# EAGLE board marbles_v70 (EAGLE 9.6.2)
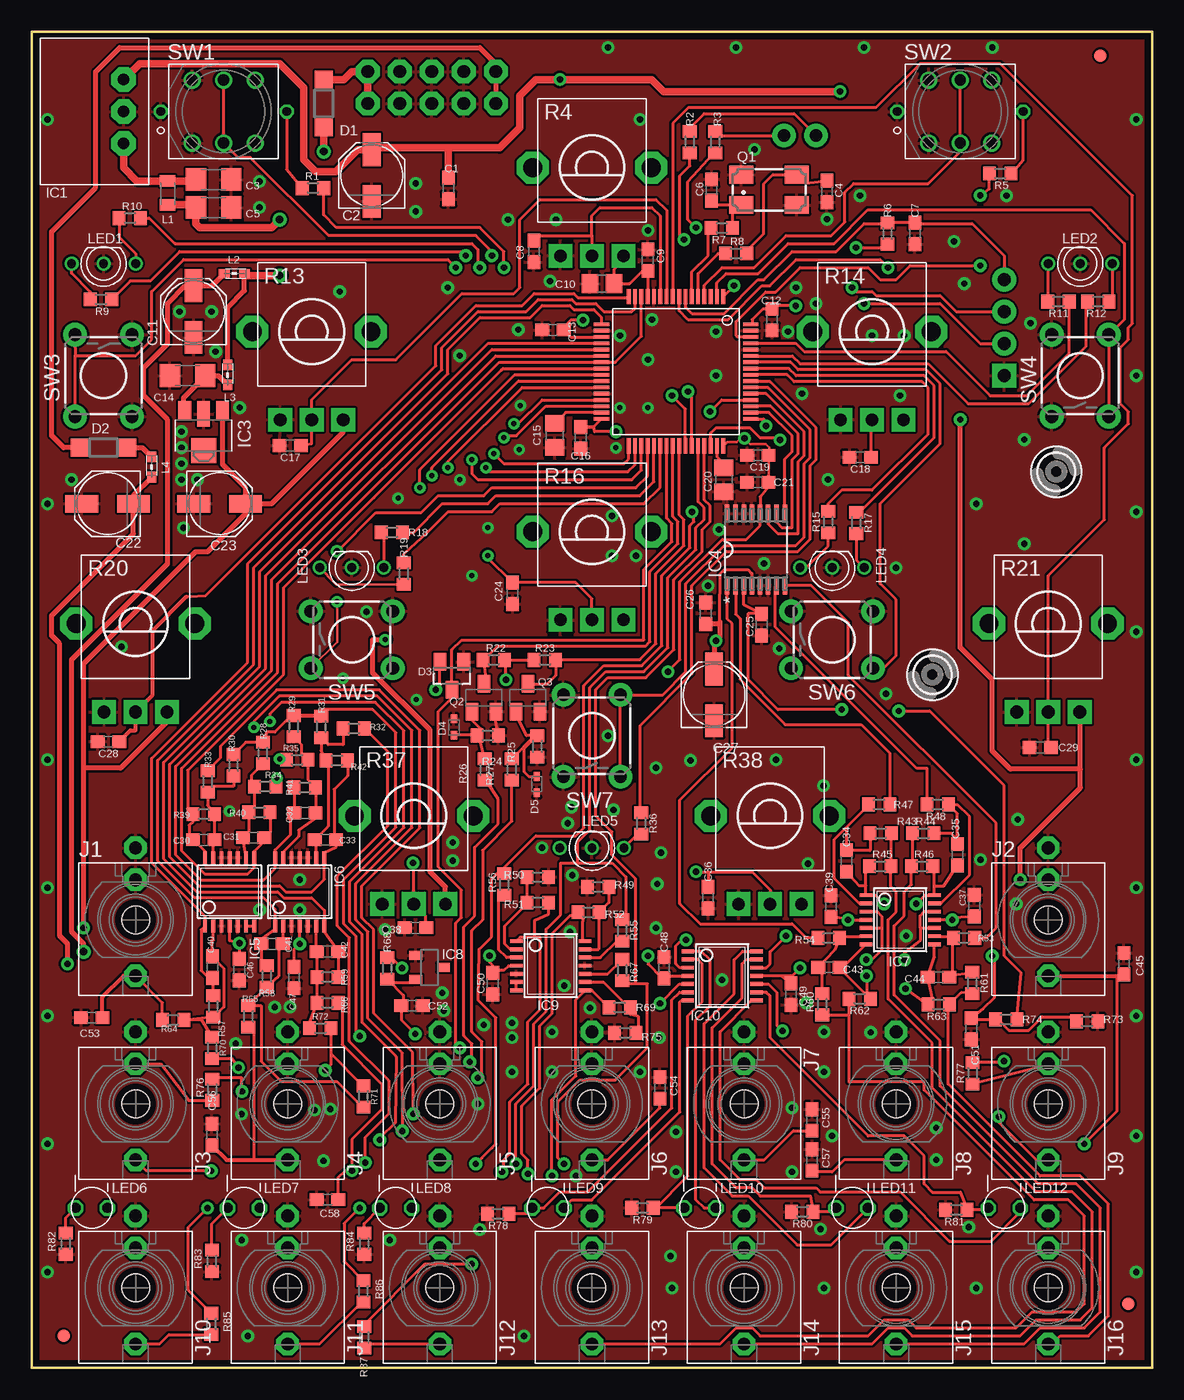
[diagram p5: board, top side]
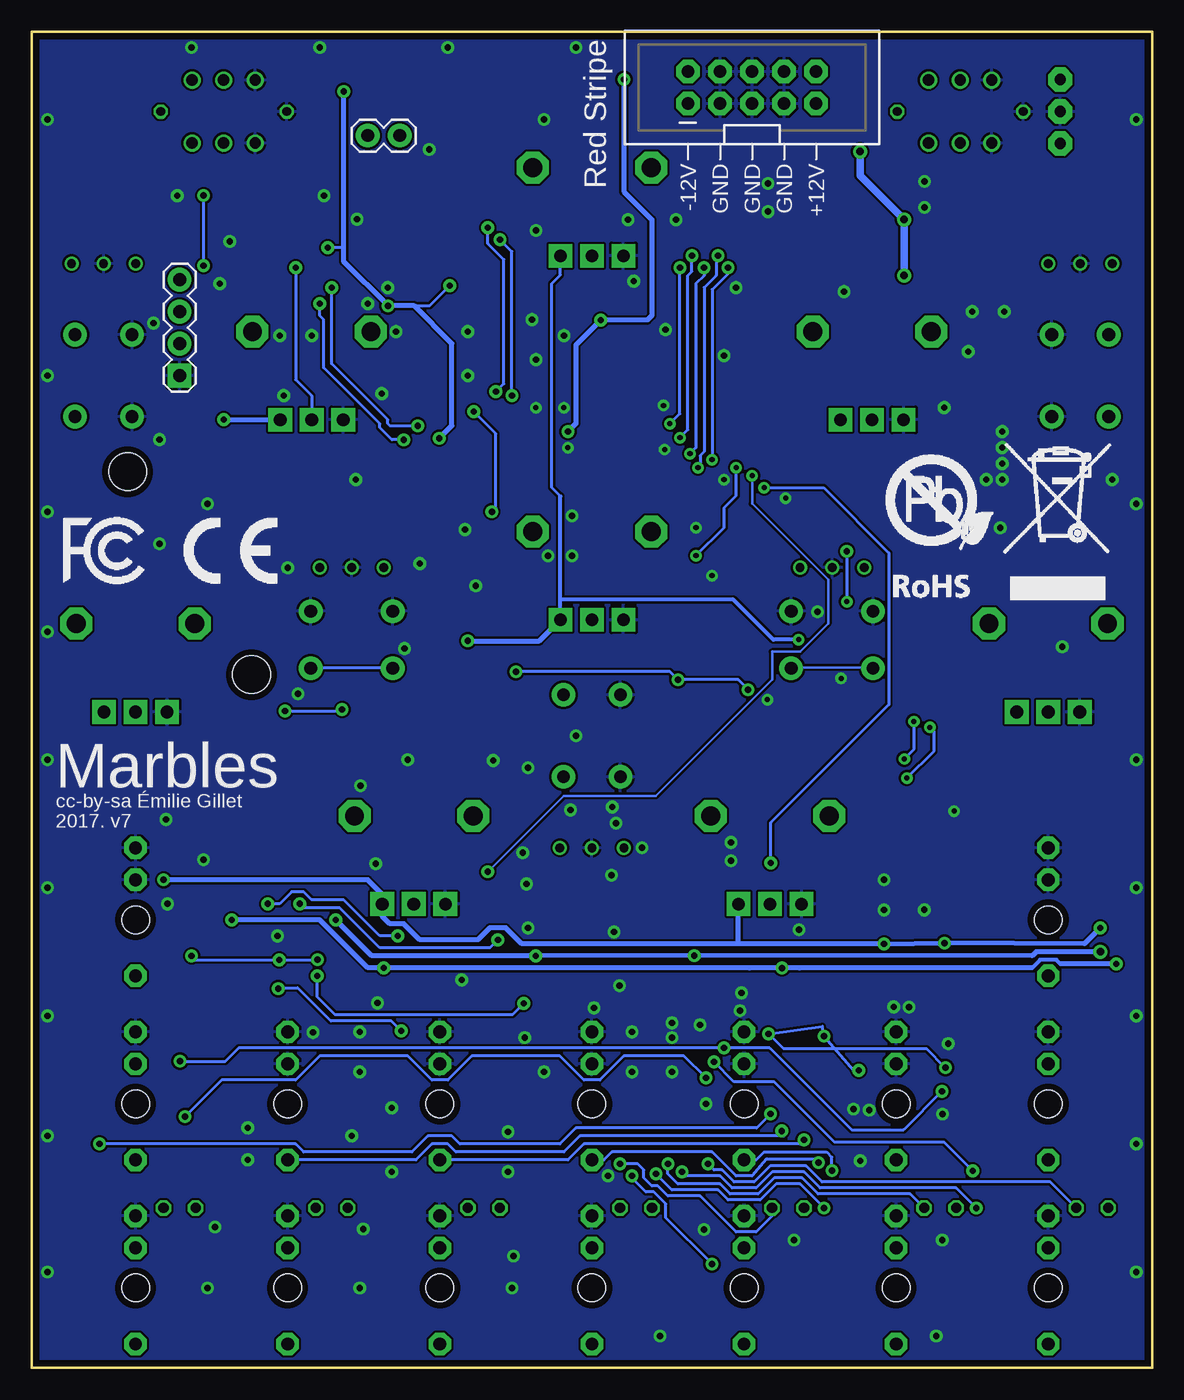
[diagram p6: board, bottom side, seen from below]

Size 88.9 x 106.05 mm. Coordinates in mm from the lower left corner, seen from the top.
Outline: 0,0 88.9,0 88.9,106.05 0,106.05 0,0
Copper layers (1*16): Top 0.035mm / dielectric 1.5mm / Bottom 0.035mm
Design rules "PCBCart-Standard-Fine *": minimum track width 8mil, minimum drill 0.2mm, track to track 7mil, track to pad 7mil, pad to pad 7mil, via to via 7mil, smd to smd 7mil, copper to edge 20mil, drill to drill 8mil, minimum pad ring 8mil, minimum via ring 10mil, stop-mask expansion 3mil, vias tented up to drill 25mil, thermal gap 8mil

## Footprints (pad centres in the part's own frame; a part is rotated, then mirrored left to right if it is on the bottom)
C0603 = smd 1.1 x 1: 1 -0.85,0; 2 0.85,0
PANASONIC_C = smd 2.6 x 1.4: + 2.05,0; - -2.05,0
C1206 = smd 1.6 x 1.8: 1 -1.4,0; 2 1.4,0
C0805 = smd 1.3 x 1.5: 1 -0.95,0; 2 0.95,0
SOD123 = smd 1.4 x 1.4: A 1.9,0; C -1.9,0
SOT23 = smd 1 x 1.4: 1 -0.95,-1.1; 2 0.95,-1.1; 3 0,1.1
SOD523 = smd 0.7 x 0.5: A 0.7,0; C -0.6,0
FIDUCIAL-1X2 = smd 1 x 1: 1 0,0
3,0TINY = hole 3: 0,0
WE78 = drill 0.9 pad 1.93 octagon: 1 -2.54,0; 2 0,0; 3 2.54,0
TQFP-10X10-64 = smd 1.2 x 0.3: 1 -5.936,3.75; 2 -5.936,3.25; 3 -5.936,2.75; 4 -5.936,2.25; 5 -5.936,1.75; 6 -5.936,1.25; 7 -5.936,0.75; 8 -5.936,0.25; 9 -5.936,-0.25; 10 -5.936,-0.75; 11 -5.936,-1.25; 12 -5.936,-1.75; 13 -5.936,-2.25; 14 -5.936,-2.75; 15 -5.936,-3.25; 16 -5.936,-3.75; 33 5.886,-3.75; 34 5.886,-3.25; 35 5.886,-2.75; 36 5.886,-2.25; 37 5.886,-1.75; 38 5.886,-1.25; 39 5.886,-0.75; 40 5.886,-0.25; 41 5.886,0.25; 42 5.886,0.75; 43 5.886,1.25; 44 5.886,1.75; 45 5.886,2.25; 46 5.886,2.75; 47 5.886,3.25; 48 5.886,3.75 | smd 0.3 x 1.2: 17 -3.75,-5.911; 18 -3.25,-5.911; 19 -2.75,-5.911; 20 -2.25,-5.911; 21 -1.75,-5.911; 22 -1.25,-5.911; 23 -0.75,-5.911; 24 -0.25,-5.911; 25 0.25,-5.911; 26 0.75,-5.911; 27 1.25,-5.911; 28 1.75,-5.911; 29 2.25,-5.911; 30 2.75,-5.911; 31 3.25,-5.911; 32 3.75,-5.911; 49 3.75,5.936; 50 3.25,5.936; 51 2.75,5.936; 52 2.25,5.936; 53 1.75,5.936; 54 1.25,5.936; 55 0.75,5.936; 56 0.25,5.936; 57 -0.25,5.936; 58 -0.75,5.936; 59 -1.25,5.936; 60 -1.75,5.936; 61 -2.25,5.936; 62 -2.75,5.936; 63 -3.25,5.936; 64 -3.75,5.936
SOT89 = smd 1 x 1.5: 1 -1.499,-1.981; 3 1.499,-1.981 | smd 1 x 2: 2 0,-1.727 | smd 2 x 2: 2@1 0,1.194
SOP65P640X110-16N = smd 1.422 x 0.356: 1 -2.845,2.286; 2 -2.845,1.626; 3 -2.845,0.965; 4 -2.845,0.33; 5 -2.845,-0.33; 6 -2.845,-0.965; 7 -2.845,-1.626; 8 -2.845,-2.286; 9 2.845,-2.286; 10 2.845,-1.626; 11 2.845,-0.965; 12 2.845,-0.33; 13 2.845,0.33; 14 2.845,0.965; 15 2.845,1.626; 16 2.845,2.286
TSSOP14_065 = smd 0.305 x 0.991: 1 -1.95,-2.718; 2 -1.3,-2.718; 3 -0.65,-2.718; 4 0,-2.718; 5 0.65,-2.718; 6 1.3,-2.718; 7 1.95,-2.718; 8 1.95,2.718; 9 1.3,2.718; 10 0.65,2.718; 11 0,2.718; 12 -0.65,2.718; 13 -1.3,2.718; 14 -1.95,2.718
DBZ_R-PDSO-G3 = smd 0.7 x 1: 1 -0.95,-1.1; 2 0.95,-1.1; 3 0,1.1
WQP_PJ_301M6 = drill 1.016 pad 1.778 octagon: P1 0,-5.715; P2 0,-3.175; P3 0,4.445 | hole 2.2: 0,0
1X04 = drill 1.016 pad 1.88 square: 1 0,0 | drill 1.016 pad 1.88: 2 2.54,0; 3 5.08,0; 4 7.62,0
1X02 = drill 1.016 pad 1.88: 1 0,0; 2 2.54,0
2X5-SHROUDED = drill 1.016 pad 1.88 octagon: 1 -1.27,5.08; 2 1.27,5.08; 3 -1.27,2.54; 4 1.27,2.54; 5 -1.27,0; 6 1.27,0; 7 -1.27,-2.54; 8 1.27,-2.54; 9 -1.27,-5.08; 10 1.27,-5.08
L2012C = smd 0.9 x 1.25: 1 -0.9,0; 2 1,0
0603 = smd 0.85 x 0.7: 1 -0.9,0; 2 0.7,0
LED-BICOLOR-THROUGHHOLE-2.54 = drill 0.7: 1 -2.54,0; 2 0,0; 3 2.54,0
LED3MM = drill 0.813 octagon: 1 -1.27,0; 2 1.27,0
CTS406 = smd 1.9 x 1.4: 1 -2.2,-1.2; 2 2.2,-1.2; 3 2.2,1.2; 4 -2.2,1.2
SOT23-BEC = smd 1 x 1.4: B -0.95,-1.1; C 0,1.1; E 0.95,-1.1
R0603 = smd 1 x 1.1: 1 -0.85,0; 2 0.85,0
ALPS_POT_VERTICAL_PS = drill 1 pad 1.88 square: P$1 -2.5,7; P$2 0,7; P$3 2.5,7 | drill 1.5 pad 2.54 octagon: P$4 -4.7,0; P$5 4.7,0
LP4OA1PBCT = drill 0.7 octagon: L1 5,0; L2 -5,0 | drill 0.9: P1 2.5,2.5; P2 0,2.5; P3 -2.5,2.5; P4 2.5,-2.5; P5 0,-2.5; P6 -2.5,-2.5
TACTILE-PTH = drill 1.016 pad 1.88: 1 -3.251,2.261; 2 3.251,2.261; 3 -3.251,-2.261; 4 3.251,-2.261

## Placement (x,y rotation side)
C1  100n  [C0603]  33.07,93.6 270 top
C2  22u  [PANASONIC_C]  26.99,94.61 90 top
C3  22u  [C1206]  14.44,94.3 0 top
C4  20p  [C0603]  63.09,93.36 90 top
C5  22u  [C1206]  14.44,92.08 0 top
C6  20p  [C0603]  53.94,93.46 270 top
C7  100n  [C0603]  70.07,90.02 270 top
C8  100n  [C0603]  39.85,88.6 270 top
C9  100n  [C0603]  48.89,87.9 90 top
C10  2.2u  [C0805]  45.24,86.04 180 top
C11  22u  [PANASONIC_C]  12.86,83.82 90 top
C12  100n  [C0603]  58.74,83.19 270 top
C13  100n  [C0603]  41.35,82.36 180 top
C14  22u  [C1206]  12.38,78.74 180 top
C15  2.2u  [C0805]  41.5,73.99 270 top
C16  100n  [C0603]  43.56,73.81 270 top
C17  100n  [C0603]  20.52,73.19 180 top
C18  100n  [C0603]  65.74,72.27 180 top
C19  100n  [C0603]  57.61,72.43 180 top
C20  2.2u  [C0805]  54.91,70.48 270 top
C21  100n  [C0603]  57.6,70.29 180 top
C22  22u  [PANASONIC_C]  6.03,68.58 180 top
C23  22u  [PANASONIC_C]  14.92,68.58 0 top
C24  100n  [C0603]  38.15,61.47 270 top
C25  470n  [C0603]  57.91,58.98 270 top
C26  100n  [C0603]  53.48,59.88 90 top
C27  22u  [PANASONIC_C]  54.14,53.41 90 top
C28  100n  [C0603]  6.1,49.7 180 top
C29  100n  [C0603]  80.01,49.24 180 top
C30  4.7n  [C0603]  13.66,41.91 180 top
C31  470p  [C0603]  17.62,42.06 0 top
C32  4.7n  [C0603]  21.68,44.04 180 top
C33  4.7n  [C0603]  23.3,41.91 0 top
C34  47p  [C0603]  64.63,40.23 270 top
C35  47p  [C0603]  73.44,40.72 270 top
C36  100n  [C0603]  53.66,37.33 270 top
C37  100n  [C0603]  74.78,36.68 270 top
C38  100n  [C0603]  30.45,34.92 180 top
C39  100n  [C0603]  63.42,36.64 90 top
C40  4.7n  [C0603]  14.35,31.81 270 top
C41  470p  [C0603]  19.06,33.66 180 top
C42  4.7n  [C0603]  23.48,33.05 0 top
C43  47p  [C0603]  63.26,31.79 0 top
C44  47p  [C0603]  71.95,31.03 180 top
C45  ESD  [C0603]  86.65,32.07 90 top
C46  100n  [C0603]  16.48,31.6 270 top
C47  100n  [C0603]  20.82,30.99 270 top
C48  100n  [C0603]  50.17,31.75 90 top
C49  100n  [C0603]  60.26,29.67 90 top
C50  100n  [C0603]  36.58,30.51 270 top
C51  470n  [C0603]  74.54,26.91 270 top
C52  470n  [C0603]  30.19,28.74 0 top
C53  ESD  [C0603]  4.78,27.81 180 top
C54  ESD  [C0603]  49.85,22.23 90 top
C55  ESD  [C0603]  61.91,19.68 90 top
C56  ESD  [C0603]  14.31,18.52 90 top
C57  ESD  [C0603]  61.91,16.51 90 top
C58  ESD  [C0603]  23.49,13.36 180 top
D1  1N5819HW  [SOD123]  23.18,100.33 90 top
D2  1N5819HW  [SOD123]  5.71,73.03 0 top
D3  BAT54S  [SOT23]  33.34,54.93 180 top
D4  1N4148  [SOD523]  33.51,50.81 90 top
D5  1N4148  [SOD523]  40.07,46.34 270 top
F1  FIDUCIAL1X2  [FIDUCIAL-1X2]  84.77,104.14 0 top
F2  FIDUCIAL1X2  [FIDUCIAL-1X2]  87,5.08 0 top
F3  FIDUCIAL1X2  [FIDUCIAL-1X2]  2.54,2.54 0 top
H3  MOUNT-HOLE3.0TINY  [3,0TINY]  81.28,71.12 0 top
H5  MOUNT-HOLE3.0TINY  [3,0TINY]  71.45,55.02 0 top
IC1  R-78E3.3-0.5  [WE78]  7.3,99.69 90 top
IC2  STM32F405RGT6  [TQFP-10X10-64]  51.12,79.06 270 top
IC3  LD2981ABU33  [SOT89]  13.65,73.98 180 top
IC4  DAC8164ICPW  [SOP65P640X110-16N]  57.47,64.94 90 top
IC5  MCP6004  [TSSOP14_065]  15.72,37.78 0 top
IC6  MCP6004  [TSSOP14_065]  21.27,37.78 0 top
IC7  OPA4171  [TSSOP14_065]  68.9,35.56 270 top
IC8  LM4040B10  [DBZ_R-PDSO-G3]  31.57,31.79 270 top
IC9  LM324PW  [TSSOP14_065]  41.18,31.92 270 top
IC10  TL074PW  [TSSOP14_065]  54.77,31.11 270 top
J1  PJ301_THONKICONN6  [WQP_PJ_301M6]  8.26,35.56 180 top
J2  PJ301_THONKICONN6  [WQP_PJ_301M6]  80.64,35.56 180 top
J3  PJ301_THONKICONN6  [WQP_PJ_301M6]  8.26,20.95 180 top
J4  PJ301_THONKICONN6  [WQP_PJ_301M6]  20.32,20.95 180 top
J5  PJ301_THONKICONN6  [WQP_PJ_301M6]  32.38,20.95 180 top
J6  PJ301_THONKICONN6  [WQP_PJ_301M6]  44.45,20.95 180 top
J7  PJ301_THONKICONN6  [WQP_PJ_301M6]  56.52,20.95 180 top
J8  PJ301_THONKICONN6  [WQP_PJ_301M6]  68.58,20.95 180 top
J9  PJ301_THONKICONN6  [WQP_PJ_301M6]  80.64,20.95 180 top
J10  PJ301_THONKICONN6  [WQP_PJ_301M6]  8.26,6.35 180 top
J11  PJ301_THONKICONN6  [WQP_PJ_301M6]  20.32,6.35 180 top
J12  PJ301_THONKICONN6  [WQP_PJ_301M6]  32.38,6.35 180 top
J13  PJ301_THONKICONN6  [WQP_PJ_301M6]  44.45,6.35 180 top
J14  PJ301_THONKICONN6  [WQP_PJ_301M6]  56.52,6.35 180 top
J15  PJ301_THONKICONN6  [WQP_PJ_301M6]  68.58,6.35 180 top
J16  PJ301_THONKICONN6  [WQP_PJ_301M6]  80.64,6.35 180 top
JP1  [1X04]  77.15,78.74 90 bottom
JP2  [1X02]  59.69,97.79 180 bottom
JP4  M05X2SHD  [2X5-SHROUDED]  31.75,101.6 90 bottom
L1  33u  [L2012C]  10.79,93.19 90 top
L2  [0603]  16.19,86.84 0 top
L3  [0603]  15.56,78.9 90 top
L4  [0603]  9.53,71.6 90 top
LED1  W115WSURKMGKW  [LED-BICOLOR-THROUGHHOLE-2.54]  5.71,87.63 180 top
LED2  W115WSURKMGKW  [LED-BICOLOR-THROUGHHOLE-2.54]  83.19,87.63 180 top
LED3  W115WSURKMGKW  [LED-BICOLOR-THROUGHHOLE-2.54]  25.4,63.5 180 top
LED4  W115WSURKMGKW  [LED-BICOLOR-THROUGHHOLE-2.54]  63.5,63.5 180 top
LED5  W115WSURKMGKW  [LED-BICOLOR-THROUGHHOLE-2.54]  44.45,41.27 180 top
LED6  WP937EGW  [LED3MM]  4.76,12.7 180 top
LED7  WP937EGW  [LED3MM]  16.83,12.7 180 top
LED8  WP937EGW  [LED3MM]  28.89,12.7 180 top
LED9  WP937EGW  [LED3MM]  40.96,12.7 180 top
LED10  WP937EGW  [LED3MM]  53.02,12.7 180 top
LED11  WP937EGW  [LED3MM]  65.09,12.7 180 top
LED12  WP937EGW  [LED3MM]  77.15,12.7 180 top
Q1  8MHz  [CTS406]  58.51,93.48 0 top
Q2  MMBT3904  [SOT23-BEC]  35.88,53.18 0 top
Q3  MMBT3904  [SOT23-BEC]  39.37,53.18 0 top
R1  39  [R0603]  22.33,93.62 180 top
R2  100  [R0603]  52.21,97.27 270 top
R3  100  [R0603]  54.24,97.27 270 top
R4  10kB  [ALPS_POT_VERTICAL_PS]  44.45,95.25 180 top
R5  39  [R0603]  76.83,94.78 0 top
R6  10k  [R0603]  67.89,90.02 270 top
R7  100  [R0603]  54.75,90.46 0 top
R8  100  [R0603]  55.88,88.44 0 top
R9  2.2k  [R0603]  5.51,84.79 180 top
R10  1.5k  [R0603]  7.8,91.24 180 top
R11  2.2k  [R0603]  81.46,84.62 180 top
R12  1.5k  [R0603]  84.61,84.62 0 top
R13  10kB  [ALPS_POT_VERTICAL_PS]  22.23,82.23 180 top
R14  10kB  [ALPS_POT_VERTICAL_PS]  66.67,82.23 180 top
R15  2.2k  [R0603]  63.18,67.12 270 top
R16  10kB  [ALPS_POT_VERTICAL_PS]  44.45,66.36 180 top
R17  1.5k  [R0603]  65.42,67.06 270 top
R18  1.5k  [R0603]  28.59,66.31 180 top
R19  2.2k  [R0603]  29.53,63.03 270 top
R20  10kB  [ALPS_POT_VERTICAL_PS]  8.26,59.05 180 top
R21  10kB  [ALPS_POT_VERTICAL_PS]  80.64,59.05 180 top
R22  10k  [R0603]  36.66,56.18 0 top
R23  10k  [R0603]  40.72,56.18 180 top
R24  100k  [R0603]  36.19,50.18 180 top
R25  100k  [R0603]  40.12,49.32 90 top
R26  100k  [R0603]  35.96,47.48 90 top
R27  100k  [R0603]  38.09,47.49 90 top
R28  200k  [R0603]  18.36,48.79 90 top
R29  200k  [R0603]  20.79,50.93 90 top
R30  200k  [R0603]  16.02,47.83 90 top
R31  200k  [R0603]  22.97,50.87 90 top
R32  100k  [R0603]  25.57,50.74 0 top
R33  100k  [R0603]  13.97,46.54 90 top
R34  100k  [R0603]  18.54,46.13 0 top
R35  100k  [R0603]  21.07,48.26 180 top
R36  1.5k  [R0603]  48.36,43.21 270 top
R37  10kB  [ALPS_POT_VERTICAL_PS]  30.32,43.81 180 top
R38  10kB  [ALPS_POT_VERTICAL_PS]  58.58,43.81 180 top
R39  33k  [R0603]  13.66,43.94 0 top
R40  33k  [R0603]  18.08,44.09 180 top
R41  33k  [R0603]  21.68,46.08 0 top
R42  33k  [R0603]  24.22,48.21 180 top
R43  100k  [R0603]  67.36,42.43 180 top
R44  100k  [R0603]  70.74,42.43 0 top
R45  1.0k  [R0603]  67.31,39.81 180 top
R46  1.0k  [R0603]  70.64,39.81 0 top
R47  23.7k  [R0603]  67.23,44.7 0 top
R48  23.7k  [R0603]  71.88,44.7 180 top
R49  39k  [R0603]  44.95,38.18 180 top
R50  39k  [R0603]  40.16,38.94 0 top
R51  56k  [R0603]  40.16,36.93 180 top
R52  56k  [R0603]  44.18,36.16 0 top
R53  23.7k  [R0603]  73.96,34.14 0 top
R54  23.7k  [R0603]  63.23,34.12 180 top
R55  10k  [R0603]  46.84,34.71 90 top
R56  10k  [R0603]  37.5,38.37 90 top
R57  33k  [R0603]  14.4,28.7 270 top
R58  33k  [R0603]  18.67,31.08 270 top
R59  33k  [R0603]  23.48,31.01 180 top
R60  100k  [R0603]  62.71,28.87 90 top
R61  100k  [R0603]  74.63,30.54 90 top
R62  1.0k  [R0603]  65.68,29.3 0 top
R63  1.0k  [R0603]  71.95,28.84 180 top
R64  100k  [R0603]  11.23,27.61 180 top
R65  100k  [R0603]  17.2,27.9 270 top
R66  100k  [R0603]  23.48,28.98 0 top
R67  10k  [R0603]  46.84,31.57 270 top
R68  1.0k  [R0603]  28.21,31.71 270 top
R69  56k  [R0603]  46.65,28.61 0 top
R70  200k  [R0603]  14.32,25.4 270 top
R71  200k  [R0603]  26.33,21.54 90 top
R72  200k  [R0603]  22.91,26.96 0 top
R73  100k  [R0603]  83.73,27.51 180 top
R74  150k  [R0603]  77.3,27.66 0 top
R75  39k  [R0603]  47.1,26.59 180 top
R76  100k  [R0603]  14.33,22.09 270 top
R77  100k  [R0603]  74.64,23.38 270 top
R78  680  [R0603]  37.01,12.24 180 top
R79  680  [R0603]  48.46,12.7 180 top
R80  680  [R0603]  61.14,12.4 180 top
R81  680  [R0603]  73.36,12.55 180 top
R82  180  [R0603]  2.71,9.87 90 top
R83  180  [R0603]  14.31,8.5 90 top
R84  180  [R0603]  26.38,9.87 90 top
R85  1.0k  [R0603]  14.26,3.49 90 top
R86  1.0k  [R0603]  26.33,6.08 90 top
R87  1.0k  [R0603]  26.38,2.44 90 top
SW1  LP4OA1PBCT  [LP4OA1PBCT]  15.24,99.69 0 top
SW2  LP4OA1PBCT  [LP4OA1PBCT]  73.66,99.69 0 top
SW3  [TACTILE-PTH]  5.71,78.74 270 top
SW4  [TACTILE-PTH]  83.19,78.74 90 top
SW5  [TACTILE-PTH]  25.4,57.78 0 top
SW6  [TACTILE-PTH]  63.5,57.78 0 top
SW7  [TACTILE-PTH]  44.45,50.16 90 top
U$2  [ROHS_BIG]  22.38,60.17 0 bottom
U$4  [CE_MEDIUM]  76.83,62.23 0 bottom
U$5  [FCC_MEDIUM]  86.36,62.23 0 bottom

## Tracks (layer width: path | path; a pad name or v marks a point on that pad's centre or on a via)
+3V3  (via drill 0.5)
  Top 0.203: IC2.48 55.17,73.48 55.95,73.48 56.25,73.77 v56.55,73.77 57.01,73.32 58.23,73.32 58.51,73.04 58.51,72.48 C19.1 58.46,70.81 58.45,70.82 C21.1 58.45,69.89 57.8,69.11 57.78,69.11
  Top 0.254: IC2.64 57.15,82.9 57.15,83.19 58,84.03 C12.1 58.98,84.28 v60.62,84.28 | v46.35,74.3 44.66,74.3 44.6,74.66 C16.1 44.56,74.66 IC2.32 | IC2.1 55.72,85.85 v55.72,85.88 | R6.2 67.38,88.9 v65.41,88.9 | v50.48,55.24 | v50.48,55.24 51.44,56.2 51.44,62.39 54.79,65.75 56.7,65.75 57.8,66.85 IC4.12 57.78,67.79 57.78,69.11 | R22.2 37.42,56.19 37.11,55.88 37.62,55.88 | v32.07,53.82 32.39,54.14 D3.2 | v37.62,54.61 37.62,55.88 | 37.62,55.88 37.62,56.18 R23.2 | IC2.19 42.75,81.81 C13.1 42.2,82.56 42.78,83.15 v43.75,83.15
  Top 0.61: v64.14,101.28 50.16,101.28 49.21,102.23 v41.91,102.23 40.01,102.23 38.73,100.97 38.73,98.42 37.13,96.83 33.07,96.83 C1.1 33.07,96.82 27.14,96.82 C2.+ 25.86,96.67 24.13,94.93 22.54,94.93 21.59,95.89 21.59,101.6 19.68,103.5 8.57,103.5 IC1.3
  Bottom 0.254: v55.72,85.88 57.33,84.28 v60.62,84.28 | 64.14,88.9 v65.41,88.9 | v32.07,53.82 32.86,54.61 v37.62,54.61 38.26,55.24 v50.48,55.24
  Bottom 0.406: v56.55,73.77 55.56,74.77 55.56,81.28 58.56,84.28 v60.62,84.28 64.14,87.8 64.14,88.9 v64.14,101.28 | v41.91,102.23 41.91,93.34 39.69,91.12 39.69,83.5 40.04,83.15 v43.75,83.15 45.72,81.18 45.72,74.93 v46.35,74.3
+3V3_A  (via drill 0.4, 0.5)
  Top 0.254: C47.1 20.82,33.2 v21.27,33.66 IC6.4 | C26.1 54.5,59.03 54.6,59.2 54.6,61.42 54.61,61.44 54.61,63.02 54.93,63.34 56.83,63.34 57.14,63.04 IC4.4 | R4.P$1 46.95,87.91 46.19,87.15 C10.1 47.45,86.04 48.52,87.11 C9.1 48.87,87.07 IC2.13 | IC5.4 15.72,33.9 v16.48,33.71 C46.1
  Top 0.406: v78.42,38.73 78.42,41.27 83.19,46.04 83.19,47.52 | v4.13,34.92 4.13,47.6 | R13.P$1 24.73,74.25 19.05,68.58 C23.+ | 4.13,47.6 4.13,55.88 13.02,64.77 13.97,64.77 16.97,67.77 C23.+ | R20.P$1 10.76,51.29 7.06,47.6 4.13,47.6 | C26.1 54.5,59.03 54.6,59.2 54.6,58 v54.29,57.7 54.14,57.54 C27.+ | v73.66,75.25 73.66,57.15 76.2,54.61 76.2,48.97 77.65,47.52 83.19,47.52 | R21.P$1 83.19,52.05 83.19,47.52 | R37.P$1 32.82,38.19 31.6,39.41 31.6,50.65 27.05,55.15 27.05,57.78 v28.05,57.78 | C23.+ 16.99,68.58 16.99,69.85 15.15,71.69 IC3.1
  Bottom 0.254: 46.95,69.17 47.62,69.85 47.62,86.04 46.95,86.72 R4.P$1
  Bottom 0.305: R16.P$1 46.95,60.96 | 46.95,60.96 46.95,69.17 | v28.05,57.78 30.05,57.78 33.22,60.96 46.95,60.96
  Bottom 0.406: v4.13,34.92 5.4,33.66 v16.48,33.71 v21.27,33.65 v21.27,33.66 32.86,33.66 | R37.P$1 32.86,36.77 32.86,33.66 | R14.P$1 69.19,75.25 v73.66,75.25 | 32.86,33.66 50.01,33.66 51.28,34.92 52.55,34.92 53.5,33.97 58.1,33.97 59.37,35.24 60.48,35.24 61.08,35.84 R38.P$1 61.08,37.58 62.23,38.73 v78.42,38.73 | v54.29,57.7 48.61,57.7 R16.P$1
ADC_DV_CV
  Top 0.254: IC2.21 36.52,80.81 18.57,62.87 18.57,55.51 10.95,47.89 10.95,40.56 13.26,38.26 19.68,38.26 20.16,37.78 22.23,37.78 23.22,38.78 IC6.8 23.22,40.88 24.15,41.32 C33.2 24,42.06 24,45.92 25.07,46.99 R42.1
ADC_DV_POT
  Top 0.254: 44.45,89.85 R4.P$2 | 44.45,89.85 44.45,91.44 45.09,92.08 49.21,92.08 49.87,91.42 IC2.11 | C8.1 40.26,89.85 44.45,89.85
ADC_LENGTH_POT  (via drill 0.4)
  Top 0.254: IC2.27 38.91,77.81 33.02,71.91 v33.02,71.44 | v36.2,64.45 36.2,64.27 C24.1 43.17,62.32 44.45,61.03 R16.P$2
  Bottom 0.254: v33.02,71.44 33.02,69.22 33.97,68.26 33.97,66.67 v36.2,64.45
ADC_T_BIAS_CV
  Top 0.254: IC2.15 47.87,84.06 47.62,83.82 45.4,83.82 44.77,84.45 43.18,84.45 42.86,84.77 40.18,84.77 39.86,84.45 39.23,83.82 35.4,83.82 32.54,80.96 32.54,79.22 25.24,71.91 17.14,63.82 17.14,55.99 9.53,48.37 9.53,40.09 13.77,35.85 IC5.1 13.46,34.76 13.46,31.54 14.05,30.96 C40.2 R57.1
ADC_T_BIAS_POT
  Top 0.203: 12.28,61.2 12.53,61.2
  Top 0.254: 12.53,61.2 13.83,61.3 32.07,79.53 32.07,81.12 35.24,84.3 38.92,84.3 39.87,85.25 43.02,85.25 43.34,84.93 47.31,84.93 IC2.16
  Top 0.305: C28.1 7.85,50.6 8.23,50.6 8.26,50.62 R20.P$2 9.6,53.4 9.6,58.52 12.28,61.2
ADC_T_JITTER_CV
  Top 0.254: IC2.20 36.22,81.31 18.1,63.18 18.1,55.67 10.48,48.05 10.48,40.41 13.1,37.78 19.53,37.78 20,37.31 22.23,37.31 23.22,36.31 IC6.7 23.22,34.61 C42.2 R59.1
ADC_T_JITTER_POT  (via drill 0.4, 0.5)
  Top 0.254: IC2.25 38.33,78.81 30.8,71.28 v30.8,69.85 | C38.1 31.24,34.94 31.24,35.9 R37.P$2 30.32,40.07 v30.26,40.07
  Bottom 0.254: v30.8,69.85 26.07,69.85 20.89,64.67 20.89,52.64 30.26,43.27 v30.26,40.07
ADC_T_RATE_CV
  Top 0.254: R58.1 18.37,31.93 18.21,32.08 C41.2 18.21,34.06 19.32,34.83 IC6.1 19.32,36.4 18.41,37.31 12.94,37.31 10,40.25 10,48.21 17.62,55.83 17.62,63.5 33.02,78.9 33.02,80.8 35.56,83.34 39.54,83.34 40.49,84.3 42.7,84.3 43.02,83.98 44.61,83.98 45.21,83.38 IC2.17
ADC_T_RATE_POT
  Top 0.254: C17.1 22.23,73.33 R13.P$2 22.23,76.83 25.4,80.01 28.89,80.01 34.13,85.25 38.26,85.25 38.73,85.72 38.73,91.12 40.32,92.71 49.53,92.71 50.37,91.87 IC2.10
ADC_X_BIAS_CV
  Top 0.254: IC2.24 37.4,79.31 37.26,79.17 27.15,69.06 20,61.91 20,55.03 12.38,47.41 12.38,44.37 R39.1 12.81,43.38 12.5,43.08 12.5,42.22 C30.2 13.18,41.85 13.18,41.59 13.77,41 IC5.14
ADC_X_BIAS_POT
  Top 0.254: IC2.9 50.87,98.76 52.11,100 66.98,100 70.48,103.5 76.83,103.5 87.31,93.03 87.31,82.87 87,82.55 87,81.6 86.36,80.96 86.36,76.52 87,75.88 87,74.93 85.09,73.03 85.09,67.31 80.64,62.87 R21.P$2 80.64,49.27 C29.1
ADC_X_SPREAD_CV
  Top 0.254: R40.1 18.93,42.52 C31.2 18.26,42.03 18.26,41.59 17.67,41 IC5.8 17.67,39.73 17.15,39.22 13.73,39.22 11.91,41.04 11.91,47.57 19.53,55.19 19.53,62.23 37.1,79.81 IC2.23 46.31,79.81 48.37,81.86 IC2.14
ADC_X_SPREAD_POT  (via drill 0.5)
  Top 0.254: IC2.8 51.37,83.89 52.07,83.19 55.24,83.19 57.92,85.86 58.56,85.86 60.64,87.95 67.31,87.95 v67.94,87.31 | R14.P$2 66.58,75.14 C18.1
  Bottom 0.254: v67.94,87.31 67.94,78.42 66.67,77.15 R14.P$2
ADC_X_STEPS_CV
  Top 0.254: R41.1 C32.2 20.52,43.74 20.52,42.31 19.32,41.11 IC6.14 19.32,39.64 18.41,38.73 13.42,38.73 11.43,40.72 11.43,47.73 19.05,55.35 19.05,62.55 36.81,80.31 IC2.22
ADC_X_STEPS_POT  (via drill 0.4, 0.5)
  Top 0.254: IC2.26 38.62,78.31 31.75,71.44 v31.75,70.8 | v52.7,39.37 53.66,39.37 | 53.66,39.37 57.15,39.37 58.58,37.94 R38.P$2 | 53.66,39.37 C36.1
  Bottom 0.203: v52.7,39.37 46.67,45.4 39.37,45.4 30.16,54.61 30.16,56.83 27.94,56.83 25.72,59.05 25.72,62.55 31.75,68.58 v31.75,70.8
AREF_-10  (via drill 0.5)
  Top 0.254: R29.2 20.62,51.78 19.3,50.46 18.67,50.46 R28.2 16.99,49.64 R30.2 | v26.04,26.32 25.7,26.56 25.7,34.29 24.75,35.24 24.75,38.76 28.89,42.9 28.89,50.41 27.06,52.24 22.97,52.24 R31.2 | v30.44,26.52 29.34,27.62 C52.1 29.5,28.9 29.5,29.57 R68.2 28.51,30.56 30.19,30.56 IC8.2 | v16.41,23.83 15.87,24.55 R70.2 | R71.2 26.28,22.39 23.76,24.91 R72.2 23.76,24.08 v23.29,23.61
  Top 0.305: R29.2 20.85,51.72 R31.2
  Bottom 0.254: v23.29,23.61 23.68,23.61 v26.04,26.32 26.17,27.12 v30.44,26.52 29.25,25.32 17.9,25.32 v16.41,23.83
DAC_MOSI
  Top 0.254: IC2.53 58.27,77.31 61.28,74.3 61.28,72.39 60.8,71.91 60.8,66.2 59.21,66.2 58.43,66.98 IC4.11
DAC_SCK
  Top 0.254: IC2.51 58.63,76.31 60.8,74.14 60.8,72.55 60.33,72.07 60.33,66.69 60.31,66.68 59.52,66.68 59.09,67.11 IC4.10
DAC_SS
  Top 0.254: IC2.50 58.49,75.81 60.33,73.98 60.33,72.71 59.75,72.14 IC4.9
DAC_X_1
  Top 0.254: IC4.2 55.84,59.81 56.2,59.45 56.2,54.63 59.78,51.05 65.81,51.05 68.08,48.78 R47.2
DAC_X_2
  Top 0.254: R48.2 71.03,47.58 70.22,47.58 59,58.79 59,62 IC4.7
DAC_X_3
  Top 0.254: R53.2 75.73,34.14 76.52,34.92 76.52,43.23 64.8,54.95 64.8,59.13 61.84,62.09 IC4.8
DAC_Y
  Top 0.254: IC4.1 55.18,59.44 55.56,59.05 55.56,49.21 51.44,45.09 51.44,36.83 53.02,35.24 60.33,35.24 61.45,34.12 R54.2
DEPRECATED
  Top 0.254: IC5.6 IC5.7
GATE_T_1  (via drill 0.5)
  Top 0.254: v52.39,67.94 52.55,67.79 52.55,67.15 52.23,66.83 52.23,65.09 50.01,62.87 50.01,57.31 48.42,55.72 45.4,55.72 43.81,54.13 43.81,42.86 43.19,42.23 40,42.23 37.5,39.73 R56.2 36.9,39.22 36.5,38.82 36.5,34.21 35.51,33.22 35.51,33.07 35.43,29.18 36.83,27.79 36.83,17.78 36.51,17.46 35.72,16.67 v35.24,16.19 | v53.82,75.88 54.74,76.81 IC2.52
  Bottom 0.254: v53.82,75.88 52.07,74.14 52.07,68.26 v52.39,67.94 | LED6.1 8.1,14.76 26.19,14.76 27.46,16.03 30.32,16.03 31.59,14.76 33.18,14.76 34.13,15.72 34.77,15.72 v35.24,16.19
GATE_T_2  (via drill 0.5)
  Top 0.254: IC2.44 52.87,68.73 53.34,68.26 53.34,67.31 52.7,66.67 52.7,64.93 50.48,62.71 50.48,57.15 48.58,55.24 45.56,55.24 44.29,53.98 44.29,42.7 43.34,41.76 43.34,40.06 | v38.42,16.19 38.42,20.95 39.85,22.38 39.85,27.3 40.82,28.28 40.82,34.82 41.97,35.97 41.97,40.06 43.34,40.06 | 43.34,40.06 46.05,40.06 47.14,38.96 47.14,35.86 R55.2
  Bottom 0.254: LED7.1 19.21,13.81 26.51,13.81 27.78,15.08 30,15.08 31.27,13.81 33.5,13.81 34.29,14.61 37.62,14.61 38.42,15.4 v38.42,16.19
GATE_T_3  (via drill 0.5)
  Top 0.254: v42.23,16.19 41.75,16.67 41.75,21.11 43.5,22.86 46.3,22.86 48.86,25.41 48.86,30.48 47.94,30.48 | IC2.45 53.37,68.87 53.82,68.42 53.82,67.15 53.37,66.7 53.18,66.52 53.18,64.77 50.96,62.55 50.96,56.99 48.74,54.77 45.72,54.77 44.77,53.82 44.77,43.81 46.04,42.55 46.04,40.71 47.92,38.82 47.92,34.47 47.94,34.45 47.94,30.48 | R67.2 46.88,30.48 47.94,30.48
  Bottom 0.254: LED8.1 30.16,12.06 31.43,10.79 33.02,10.79 35.88,13.65 38.42,13.65 39.21,14.45 39.69,14.45 40.32,15.08 40.32,15.72 40.8,16.19 v42.23,16.19
GND  (via drill 0.4, 0.5)
  Top 0.254: Q2.E 36.72,51.97 R24.1
  other vias: 63.18,70.48 62.23,84.45 75.26,40.34 41.59,91.12 20.5,28.65 19.29,28.63 15.72,44.2 21.27,38.73 21.27,36.35 41.13,86.24 30.48,91.76 30.48,93.98 63.09,91.15 35.56,10.99 50.67,8.89 62.59,11.02 74.35,11.18 61.45,28.97 46.35,73.03 28.03,34.77 32.7,28.35 38.1,27.38 48.26,23.5 32.58,29.76 22.45,20.46 28.42,10.16 16.67,10.16 62.87,26.67 62.87,23.5 60.33,20.64 60.33,15.56 51.12,18.73 51.12,15.56 49.53,34.92 49.53,47.62 58.1,63.83 61.59,40.01 78.11,36.83 78.23,43.52 46.67,81.92 38.77,76.37 38.61,82.39 24.45,85.41 33.02,85.72 37.78,91.12 29.08,69.01 46.67,76.2 49.21,83.19 65.71,93.01 47.94,64.45 46.04,64.45 60.64,85.72 73.18,89.38 1.27,7.62 1.27,17.78 1.27,27.94 1.27,38.1 1.27,48.26 45.72,104.78 87.63,7.62 87.63,18.41 87.63,27.94 87.63,38.1 87.63,58.42 87.63,67.94 87.63,78.74 24.69,54.71 59.05,48.26 48.26,99.06 74.93,68.58 78.74,65.41 39.05,2.54 17.14,2.54 50.8,6.35 62.87,6.35 74.93,6.35 48.9,80.01 54.29,78.74 48.9,76.2 54.29,82.23 38.68,72.87 16.19,25.74 16.65,20.15 54.77,30.8 69.38,34.29 66.57,26.63 77.34,93.01 79.24,82.91 46.16,44.28 46.04,67.63 23.16,16.43 66.67,81.92 69.22,81.92 49.63,38.4 48.9,90.27 87.63,48.26 60,82.23 57.35,96.68 63.5,18.41 71.75,19.05 71.75,16.51 35.41,20.95 68.9,77.15 73.98,86.04 54.52,66.53 49.78,26.21 44.29,28.57 42.25,30.33 42.89,39.1 40.49,41.28 42.71,34.61 35.88,27.23 41.27,23.5 41.27,26.67 38.1,26.21 38.1,23.5 18.07,94.15 18.07,92.08 30.53,53.04 78.74,73.66 43.18,15.24 11.75,83.82 14.29,83.82 14.61,80.64 11.91,70.48 12.06,66.67 3.17,70.48 7.14,57.23 1.27,68.58 33.97,80.33 53.66,62.06 52.27,48.21 36.2,66.67 34.92,62.87 26.57,59.99 33.97,70.48 59.31,57.09 18.1,36.35 42.84,44.51 42.53,43.22 33.41,41.69 33.41,40.25 23.7,20.55 68.58,63.5 67.77,53.49 62.81,46.2 49.94,40.89 45.72,50.16 61.12,77.31 55.88,104.78 66.04,104.78 76.2,104.78 87.63,99.06 1.27,99.06 11.91,74.3 11.91,73.03 11.91,71.76 13.18,70.48 16.51,76.2
  pour Bottom: -1.68,106.05 -1.68,0 88.9,0 88.9,106.05
  pour Top: -0.91,106.05 88.9,106.05 88.9,0 -0.91,0
LED_T_DV  (via drill 0.4, 0.5)
  Top 0.254: v37.47,87.31 37.47,88.58 35.56,90.49 24.18,90.49 23.18,91.49 R1.1 | v38.26,74.93 38.61,74.93 40.49,76.81 IC2.29
  Bottom 0.254: v38.26,74.93 37.47,75.72 v37.47,87.31
LED_T_MODE_G  (via drill 0.4, 0.5)
  Top 0.254: IC2.33 47.37,72.13 46.99,71.75 37.47,71.75 v36.67,72.55 | v35.56,87.31 35.4,87.47 35.4,88.74 34.92,89.22 11.43,89.22 11.39,89.17 9.32,91.24 R10.1
  Bottom 0.254: v36.67,72.55 36.2,73.03 36.2,86.04 35.56,86.68 v35.56,87.31
LED_T_MODE_R  (via drill 0.4, 0.5)
  Top 0.254: IC2.34 47.87,71.68 47.31,71.12 36.35,71.12 v36.04,71.44 | v34.45,88.27 34.45,88.42 34.29,88.58 11.75,88.58 9.41,86.25 7.82,86.25 R9.1
  Bottom 0.254: v36.04,71.44 35.88,71.6 35.88,72.39 35.56,72.71 35.56,85.72 34.61,86.68 34.61,88.11 v34.45,88.27
LED_T_RANGE_G
  Top 0.254: R18.1 30.3,66.31 32.58,68.58 36.2,68.58 36.83,69.22 48.26,69.22 49.37,70.32 IC2.37
LED_T_RANGE_R
  Top 0.254: R19.1 29.53,64.58 30.47,65.45 31.26,66.17 33.04,67.94 36.51,67.94 37.15,68.58 48.58,68.58 49.87,69.87 IC2.38
LED_X_DV  (via drill 0.5)
  Top 0.254: IC2.62 55.99,81.81 55.88,81.92 55.88,83.03 58.24,85.38 59.03,85.38 60.96,87.31 66.36,87.31 67.31,86.36 68.58,86.36 69.69,87.47 v75.25,87.47 | v75.25,93.03 75.4,93.03 75.9,93.53 75.98,93.55 R5.1
  Bottom 0.254: v75.25,87.47 v75.25,93.03
LED_X_EXT_G
  Top 0.254: IC2.55 57.1,78.26 58.58,78.26 62.23,74.61 62.23,72.07 61.75,71.6 61.75,65.76 60.79,64.8 55.11,64.8 52.39,62.07 52.39,55.09 48.26,50.96 48.26,44.16 R36.1
LED_X_MODE_G
  Top 0.254: IC2.59 60.34,80.31 60.96,79.69 71.12,79.69 74.3,76.52 79.1,76.52 83.61,81.03 83.61,84.47 R12.1
LED_X_MODE_R
  Top 0.254: IC2.61 60.62,81.31 61.28,80.64 72.55,80.64 76.04,77.15 78.93,77.15 82.31,80.53 R11.1
LED_X_RANGE_G
  Top 0.254: IC2.57 60.08,79.31 60.64,78.74 70.8,78.74 71.6,77.95 71.6,73.81 65.7,67.91 R17.1
LED_X_RANGE_R
  Top 0.254: IC2.56 59.94,78.81 60.48,78.26 70.64,78.26 71.12,77.79 71.12,74.12 66.65,69.65 64.25,69.65 63.18,68.58 R15.1
MORPH_IN
  Top 0.254: J1.P3 10.38,28.99 R64.2
  Top 0.305: J1.P3 7.3,31.11 5.62,29.44 C53.1
MORPH_IN1  (via drill 0.4, 0.5)
  Top 0.254: v27.62,18.1 27.62,18.25 28.84,19.47 28.93,24.72 26.23,27.42 26.23,34.4 25.23,35.4 25.23,38.59 29.53,42.89 29.53,50.57 27.28,52.82 19.82,52.82 18.91,51.91 v18.91,51.3 | R35.2 20.16,48.32 v19.67,48.32 | J7.P3 58.1,16.51 60.43,18.84 C55.1
  Bottom 0.254: J7.P3 46.35,16.51 45.09,17.78 27.94,17.78 v27.62,18.1 | v18.91,51.3 18.91,49.09 v19.67,48.32
MORPH_IN3
  Top 0.203: 17.46,16.51 17.78,16.51
  Top 0.254: R65.2 17.63,26.62 17.63,16.51
  Top 0.305: C56.1 15.47,16.51 17.46,16.51 17.63,16.51 | 17.78,16.51 J4.P3
MORPH_IN4  (via drill 0.4, 0.5)
  Top 0.254: v17.64,50.84 17.64,51.3 19.66,53.31 27.43,53.31 30.16,50.58 30.16,42.88 25.72,38.43 25.72,35.55 26.67,34.6 26.67,27.74 29.42,24.99 29.45,18.86 v29.4,18.81 | v19.47,46.8 v19.48,46.79 19.48,46.22 R34.2 | C57.1 62.02,15.56 63.5,15.56 64.45,16.51 J8.P3
  Bottom 0.254: J8.P3 58.42,16.51 57.15,17.78 55.88,17.78 55.24,17.14 46.67,17.14 45.4,18.41 29.21,18.41 v29.4,18.81 | v17.64,50.84 17.34,50.53 17.34,48.93 v19.47,46.8
MORPH_IN5  (via drill 0.5)
  Top 0.254: v26.47,16.31 26.47,18.29 28.33,20.16 28.33,22.8 25.22,25.92 25.22,34.13 24.27,35.08 24.27,39.04 28.26,43.03 28.26,48.9 R32.2 | J6.P3 45.72,16.51 49.85,20.64 C54.1
  Bottom 0.254: J6.P3 43.5,16.51 42.86,17.14 34.92,17.14 33.02,15.24 31.75,15.24 30.86,16.28 30.58,16.61 26.77,16.61 v26.47,16.31
MORPH_IN6  (via drill 0.5)
  Top 0.254: C58.1 24.34,15.13 24.87,15.66 v25.41,15.66 25.41,18.13 27.79,20.51 27.79,22.51 24.64,25.66 24.64,28.68 R66.2
  Bottom 0.254: v25.41,15.66 25.41,16.73 25.83,17.14 30.8,17.14 31.43,16.51 J5.P3
MORPH_IN7  (via drill 0.5)
  Top 0.254: v30.28,20.17 30.23,25.04 27.13,28.14 27.13,34.78 26.19,35.72 26.19,38.26 30.8,42.86 30.8,50.6 27.6,53.8 19.45,53.8 14.98,49.33 14.98,48.4 R33.2 | J2.P3 86.09,31.11 86.09,20.37 v83.5,17.78
  Top 0.305: C45.1 86.55,31.11 J2.P3
  Bottom 0.254: v83.5,17.78 67.94,17.78 67.31,17.14 58.74,17.14 57.47,18.41 55.56,18.41 54.93,17.78 46.99,17.78 45.72,19.05 31.39,19.05 v30.28,20.17
N$1
  Top 0.254: SW1.L1 20.24,95.11 R1.2
N$2
  Top 0.254: R5.2 78.28,95.37 78.66,95.85 SW2.L1
N$3
  Top 0.254: IC9.12 45.12,32.57 46.41,33.86 R55.1
N$4
  Top 0.406: IC3.3 12.06,76.05 12.06,76.99 13.78,78.71 C14.1 14.82,78.74 L3.1
N$5
  Top 0.254: IC6.2 19.97,33.66 C41.1 19.61,33.35 19.61,31.08 R58.2 R65.1 18.21,28.75 18.21,24.34 19.82,22.74 24.23,22.74 26.28,20.69 R71.1
N$6  (via drill 0.6)
  Top 0.406: L2.2 16.89,85.47 15.56,84.14 L3.2
  Top 0.61: v19.68,91.12 19.05,90.49 13.34,90.49 13.04,90.78 C5.1 12.83,92.29 L1.1 | L2.2 17.05,86.68 v19.68,86.68 | v23.18,96.52 | v23.18,96.52 D1.C
  Bottom 0.61: v19.68,86.68 v19.68,91.12 23.18,94.61 v23.18,96.52
N$7
  Top 0.254: R7.1 53.66,90.21 53.66,88.27 52.37,86.97 IC2.6
N$8
  Top 0.254: R8.1 54.46,88.44 52.87,86.84 IC2.5
N$9
  Top 0.254: LED3.3 24.14,62.22 R19.2
N$10
  Top 0.406: L4.2 8.8,73.03 D2.A
N$11
  Top 0.254: R70.1 13.49,27.61 R64.1 12.49,27.61 R57.2 14.45,27.85 15.26,28.65 15.26,31.7 14.35,32.61 C40.1 14.35,33.99 14.37,33.96 14.42,33.93 IC5.2
N$12
  Top 0.254: R18.2 27.94,66.1 LED3.1
N$13
  Top 0.254: IC2.47 54.37,72.31 54.91,71.77 C20.1
N$14  (via drill 0.5)
  Top 0.254: v37.31,15.56 37.47,15.72 37.47,16.51 37.94,16.99 37.94,21.11 39.37,22.54 39.37,27.46 40.35,28.44 40.35,34.17 39.93,34.17 | v13.97,12.7 12.43,11.16 12.43,6.17 R85.2 | R51.1 41.01,36 39.89,35.49 39.89,34.2 39.93,34.17 | IC9.1 38.76,34.17 39.93,34.17
  Bottom 0.254: v13.97,12.7 15.56,14.29 26.35,14.29 27.62,15.56 30.16,15.56 31.43,14.29 33.34,14.29 34.29,15.24 36.99,15.24 v37.31,15.56
N$15
  Top 0.254: R72.1 22,27.3 R66.1 R59.2 C42.1 22.57,33.05 IC6.6
N$16
  Top 0.254: LED1.3 3.17,86.87 4.66,85.38 R9.2
N$17
  Top 0.254: R28.1 17.44,47.03 17.44,46.37 R34.1 17.69,44.55 R40.2 17.23,42.52 C31.1 17.04,40.53 IC5.9
N$18
  Top 0.254: LED2.3 80.61,87.59 R11.2
N$19
  Top 0.254: C15.1 42.37,75.81 IC2.31
N$20
  Top 0.254: LED2.1 85.72,84.89 R12.2
N$21
  Top 0.254: LED4.3 61.45,63.5 63.18,65.23 R15.2
N$22
  Top 0.254: LED1.1 8.26,88.42 6.95,89.73 R10.2
N$23
  Top 0.254: LED4.1 65.42,64.12 R17.2
N$24
  Top 0.254: J10.P3 10.16,1.91 10.9,2.64 R85.1
N$25
  Top 0.254: R30.1 16.02,46.15 14.43,46.15 R33.1 13.97,44.66 R39.2 C30.1 14.42,41.39 IC5.13
N$26
  Top 0.254: R50.1 R51.2 39.31,36.84 37.53,35.06 37.53,33.66 37.97,33.22 IC9.2
N$27
  Top 0.254: R29.1 21.4,49.47 21.4,48.72 21.46,48.72 R35.1 21.92,46.69 R41.2 C32.1 22.53,43.63 21.19,42.67 21.19,42.18 19.97,40.96 IC6.13
N$28
  Top 0.254: LED6.2 2.71,11.91 R82.2
N$29
  Top 0.254: R56.1 37.04,37.06 37.04,33.21 37.68,32.57 IC9.3
N$30
  Top 0.254: IC9.7 IC9.6
N$31
  Top 0.254: R32.1 24.72,49.45 24.71,49.47 23.53,49.47 R31.1 22.97,49.01 R42.2 23.52,48.06 23.52,42.98 C33.1 22.57,41.83 IC6.9
N$32
  Top 0.61: C3.1 12.93,94.19 L1.2 8.37,94.19 7.3,95.25 IC1.1
N$33
  Top 0.254: R2.1 52.21,98.39 53.35,99.52 60.5,99.52 JP2.2
N$34  (via drill 0.5)
  Top 0.254: v39.37,15.4 39.37,16.51 38.89,16.99 38.89,20.8 40.32,22.23 40.32,27.15 41.3,28.12 41.3,34.47 42.69,35.87 43.03,35.87 R52.1 43.77,35.73 43.7,35.32 43.7,34.07 IC9.14 | v26.04,12.7 24.8,11.47 24.8,8.46 R86.2
  Bottom 0.254: v26.04,12.7 27.94,14.61 29.84,14.61 31.11,13.34 33.66,13.34 34.45,14.13 38.1,14.13 v39.37,15.4
N$35
  Top 0.254: R49.1 45.8,36.92 R52.2 44.98,36.11 44.98,33.22 IC9.13
N$36  (via drill 0.5)
  Top 0.254: J9.P3 79.69,16.51 76.72,19.48 v76.72,19.95 | v35.4,23.02 35.72,23.34 35.72,25.88 34.92,26.67 34.92,34.7 35.78,35.56 35.78,41.08 38.09,43.39 R27.1
  Bottom 0.254: v76.72,19.95 73.81,22.86 67.94,22.86 66.04,24.77 59.05,24.77 57.15,22.86 55.88,22.86 53.98,24.77 46.99,24.77 45.09,22.86 43.81,22.86 41.91,24.77 37.15,24.77 v35.4,23.02
N$37
  Top 0.254: R67.1 46.84,32.39 45.72,31.27 IC9.10
N$38  (via drill 0.5)
  Top 0.254: R87.2 26.38,3.43 31.2,8.26 v34.92,8.26 | v41.27,15.24 41.27,21.27 43.18,23.18 43.18,29.21 43.9,29.93 IC9.8 44.44,29.97 R69.1
  Bottom 0.254: v34.92,8.26 38.58,11.91 38.58,13.02 39.53,13.97 40.16,13.97 41.27,15.08 v41.27,15.24
N$39
  Top 0.254: J11.P3 22.86,1.91 26.19,5.23 R86.1
N$40
  Top 0.254: R87.1 26.7,1.91 J12.P3
N$41
  Top 0.254: R75.1 48.11,26.75 48.11,27.92 47.5,28.05 R69.2 47.37,28.61 45.36,30.62 IC9.9
N$42
  Top 0.254: LED5.1 48.08,42.36 R36.2
N$44
  Top 0.254: LED7.2 14.31,11.46 R83.2
N$45  (via drill 0.5)
  Top 0.254: v66.23,31.11 66.23,29.6 R62.2 64.11,31.73 C43.2 64.36,31.79 IC7.7 | v49.85,28.93 51.39,30.46 IC10.5
  Bottom 0.254: v66.23,31.11 66.23,29.44 64.85,28.05 50.73,28.05 v49.85,28.93
N$46
  Top 0.254: J9.P2 80.54,24.02 R77.2
N$47
  Top 0.254: J3.P2 10.24,24.13 12.47,21.23 R76.2
N$48
  Top 0.254: LED8.2 26.38,11.46 R84.2
N$49
  Top 0.254: J15.P3 78.74,1.91 80.01,3.17 83.5,3.17 84.77,4.45 84.77,12.7 82.87,14.61 79.85,14.61 72.07,22.38 72.07,25.95 68.43,29.59 68.43,35.09 69.22,35.88 69.22,37.78 69.79,38.35 R46.1 69.72,39.88 69.86,40.01 69.89,39.94 R44.1
N$50
  Top 0.254: R26.2 35.51,50.01 R24.2 | R24.2 35.3,50.21 D4.C | Q2.B 34.92,51.44 35.64,50.72 R24.2
N$51
  Top 0.254: R3.1 54.23,97.79 JP2.1
N$52
  Top 0.254: R25.2 39.92,50.17 R27.2 | Q3.B 38.42,51.89 39.27,50.17 R25.2 | R25.2 39.05,49.1 39.05,47.33 39.44,46.94 D5.C
N$53
  Top 0.254: J13.P3 54.61,1.91 55.88,3.17 57.15,3.17 57.78,2.54 66.36,2.54 67.63,3.81 69.53,3.81 70.17,3.17 78.11,3.17 79.38,4.45 82.87,4.45 83.5,5.08 83.5,12.06 82.23,13.34 79.53,13.34 70.8,22.07 70.8,22.7 64.83,22.7 R62.1 64.83,28.02 R60.1
N$54
  Top 0.254: R44.2 72.96,42.43 73.44,41.95 C35.1 73.44,43.99 R48.1 73.44,44.7 74.4,43.75 74.4,39.12 72.14,36.86 IC7.13
N$56
  Top 0.61: JP4.9 JP4.10 25.4,102.87 24.77,102.23 D1.A
N$57  (via drill 0.5)
  Top 0.254: v14.25,15.65 9.12,15.65 J3.P3 | v34.77,24.29 34.92,24.45 | 34.92,24.45 | 34.92,24.45 34.92,25.72 34.29,26.35 34.29,35.01 35.15,35.87 35.15,41.31 37.01,43.17 37.01,45.14 36.12,46.55 R26.1
  Bottom 0.254: v14.25,15.65 16.54,17.93 25.22,17.93 30,22.71 33.19,22.71 v34.77,24.29
N$58
  Top 0.254: J16.P3 80.96,1.91 81.6,2.54 83.82,2.54 85.41,4.13 85.41,13.02 83.19,15.24 80.01,15.24 72.71,22.54 72.71,28.84 R63.1 73.75,29.79 R61.1
N$59
  Top 0.254: R61.2 72.82,31.16 C44.1 73.03,31.05 73.03,34.12 | 73.03,34.12 R53.1 | IC7.9 72.89,34.26 73.03,34.12
N$60
  Top 0.254: R43.2 66.51,41.06 C34.1 64.63,42.9 | IC7.2 65.67,36.86 63.67,38.86 63.67,41.94 64.63,42.9 | R47.1 66.38,44.65 64.63,42.9
N$61
  Top 0.254: R60.2 62.71,31.79 C43.1 63.71,33.18 R54.1 64.14,34.26 IC7.6
N$62
  Top 0.254: R8.2 56.73,88.64 58.08,89.99 58.08,93.95 58.81,94.69 Q1.3 61.4,93.99 C4.2
N$63
  Top 0.254: J14.P3 66.67,1.91 67.94,3.17 69.22,3.17 69.85,2.54 78.42,2.54 79.69,3.81 83.19,3.81 84.14,4.76 84.14,12.38 82.55,13.97 79.69,13.97 71.44,22.23 71.44,25.78 67.94,29.27 67.94,35.56 68.58,36.2 68.58,37.78 68.16,38.2 R45.1 68.21,39.87 R43.1
N$64
  Top 0.406: D2.C 2.54,73.03 1.59,73.98 1.59,90.17 5.08,93.66 5.08,102.87 6.99,104.78 35.56,104.78 36.83,103.5 JP4.2 JP4.1
N$65
  Top 0.254: C6.2 54.39,92.28 Q1.1 55.6,91.58 R7.2
N$67
  Top 0.254: R78.1 39.23,12.24 LED9.2 40.64,12.7 41.91,13.97 44.13,13.97 50.8,20.64 50.8,29.22 51.4,29.82 IC10.6
N$68
  Top 0.254: LED9.1 42.86,13.34 44.45,13.34 51.44,20.32 51.44,29.05 51.55,29.16 IC10.7
N$70  (via drill 0.5)
  Top 0.254: v51.91,33.97 51.59,33.97 51.12,33.5 51.12,32.07 51.42,31.77 IC10.3 | R45.2 66.18,39.53 66.18,38.26 | C34.2 65.65,38.26 66.18,38.26 | 66.18,38.26 IC7.1 66.95,37.51 v67.63,36.83
  Bottom 0.254: v67.63,36.83 67.31,36.51 64.45,36.51 61.28,33.34 52.55,33.34 v51.91,33.97
N$71
  Top 0.254: LED10.2 R79.1 49.43,12.6 52.07,15.24 52.07,27.94 53.18,29.05 53.18,32.07 52.83,32.41 IC10.2
N$72
  Top 0.254: LED10.1 53.34,12.7 52.7,13.34 52.7,27.62 53.82,28.73 53.82,32.38 53.14,33.06 IC10.1
N$73  (via drill 0.5)
  Top 0.254: v59.85,34.29 58.58,33.02 58.58,32.07 58.28,31.77 IC10.12 | R46.2 71.61,39.69 71.61,38.26 | 71.61,38.26 IC7.14 70.85,37.51 v70.17,36.83 | C35.2 72.36,38.26 71.61,38.26
  Bottom 0.254: v59.85,34.29 61.28,34.29 64.14,37.15 66.67,37.15 67.31,37.78 68.26,37.78 69.22,36.83 v70.17,36.83
N$74
  Top 0.254: LED11.2 63.51,12.39 R80.1 61.79,13.65 57.78,13.65 57.15,14.29 55.88,14.29 53.98,16.19 53.98,26.99 56.36,29.37 56.36,32.07 56.7,32.41 IC10.13
N$75
  Top 0.254: LED11.1 63.42,9.77 60.72,9.77 56.83,13.65 55.56,13.65 53.34,15.88 53.34,27.3 55.72,29.69 55.72,32.38 56.4,33.06 IC10.14
N$76  (via drill 0.5)
  Top 0.254: v69.33,30.11 71.07,28.84 R63.2 71.48,29.22 C44.2 71.61,32.58 IC7.8 | v59.57,26.75 59.11,27.2 59.11,29.79 58.44,30.46 IC10.10
  Bottom 0.254: v59.57,26.75 60.36,27.53 65.16,27.53 67.79,30.16 69.31,30.16 v69.33,30.11
N$77
  Top 0.254: LED12.2 75.73,12.55 R81.1 73.68,13.95 73.67,13.96 71.45,13.96 70.8,14.61 70.8,16.83 69.22,18.41 66.36,18.41 58.58,26.19 58.58,29.53 58.29,29.82 IC10.9
N$78
  Top 0.254: LED12.1 78.42,12.38 76.11,10.07 72.8,10.07 68.9,13.97 62.55,13.97 62.23,14.29 58.1,14.29 57.47,14.92 56.2,14.92 54.61,16.51 54.61,26.67 57.1,29.16 IC10.8
NORMALIZATION_PROBE  (via drill 0.5)
  Top 0.254: R76.1 14.29,23.01 16.69,23.01 v16.69,21.95 | v33.97,25.4 33.66,25.72 33.66,35.3 34.09,35.74 34.09,37.93 32.25,39.77 32.25,52.08 33.34,53.17 D3.3 33.34,56.99 34.11,57.76 48.55,57.76 48.58,57.78 48.58,63.34 50.8,65.56 50.8,66.99 50.37,67.42 IC2.39 | v77.13,24.35 77.24,24.23 R77.1
  Bottom 0.254: v16.69,21.95 19.74,18.9 23.85,18.9 30.35,25.4 v33.97,25.4 72.47,25.4 73.55,24.32 v77.13,24.35
RESET
  Top 0.254: IC2.7 51.91,84.95 51.91,84.14 52.39,83.66 54.93,83.66 57.61,86.35 58.09,86.35 60.33,88.58 63.82,88.58 66.04,90.81 67.71,90.81 R6.1 C7.1 70.25,90.81 74.61,90.81 77.15,88.27 JP1.4
RX  (via drill 0.5)
  Top 0.254: v52.7,90.49 52.07,91.12 52.07,94.14 54.13,96.39 R3.2 | v52.07,77.47 52.37,77.17 IC2.43
  Bottom 0.254: v52.7,90.49 52.7,89.22 51.44,87.95 51.44,78.11 v52.07,77.47
SW_T_DV  (via drill 0.4, 0.5)
  Top 0.254: SW1.P2 SW1.P5 16.39,96.04 17.37,96.04 23.56,89.85 35.24,89.85 36.51,88.58 v36.51,88.27 | v37.47,73.82 37.62,73.98 38.46,73.98 40.79,76.31 IC2.30
  Bottom 0.254: v36.51,88.27 36.51,87 36.83,86.68 36.83,74.45 v37.47,73.82
SW_T_MODE  (via drill 0.4, 0.5)
  Top 0.254: IC2.35 48.37,71.23 47.62,70.48 35.4,70.48 34.92,70.96 v34.92,72.07 | v33.66,87.31 33.02,87.95 12.06,87.95 9.53,85.41 9.53,81.6 8.26,80.33 3.49,80.33 3.45,80.37 | 3.45,80.37 3.45,80.96 SW3.3 | SW3.4 3.45,80.37
  Bottom 0.254: v34.92,72.07 34.92,85.57 33.66,86.84 v33.66,87.31
SW_T_RANGE  (via drill 0.4, 0.5)
  Top 0.203: v24.23,60.81 24.23,57.61 SW5.3
  Top 0.254: v24.23,64.8 27.3,67.87 30.91,67.87 32.26,69.22 35.88,69.22 36.51,69.85 47.94,69.85 48.87,70.78 IC2.36
  Bottom 0.203: SW5.4 28.57,55.56 22.23,55.56 SW5.3
  Bottom 0.254: v24.23,64.8 v24.23,60.81
SW_X_DV
  Top 0.254: IC2.4 53.37,85.91 54.77,87.31 57.31,87.31 59.85,89.85 63.44,89.85 64.52,90.93 64.52,93.28 65.22,93.98 71.12,93.98 73.66,96.52 SW2.P5 SW2.P2
SW_X_EXT
  Top 0.254: SW7.3 SW7.4 50.08,53.42 51.91,55.24 51.91,62.23 54.95,65.27 60.63,65.27 61.28,65.92 61.28,71.75 61.75,72.23 61.75,74.45 58.42,77.79 57.07,77.79 IC2.54
SW_X_MODE
  Top 0.254: IC2.2 54.37,86.12 55.09,86.84 57.63,86.84 60.01,89.22 63.66,89.22 66.34,91.9 84,91.9 86.68,89.22 86.68,83.19 85.48,81.99 SW4.4 SW4.3
SW_X_RANGE
  Top 0.254: IC2.58 60.21,79.81 60.8,79.22 70.96,79.22 | SW6.4 67.59,55.52 68.58,56.52 68.58,60.96 67.31,62.23 67.31,68.58 72.07,73.34 72.07,78.11 70.96,79.22 | 70.96,79.22
  Bottom 0.254: SW6.3 SW6.4
SWCLK  (via drill 0.5)
  Top 0.254: IC2.49 58.04,75.31 58.27,75.08 v58.27,74.75 | v65.09,85.72 65.41,85.41 66.67,85.41 66.99,85.09 72.07,85.09 73.34,83.82 JP1.3
  Bottom 0.254: v58.27,74.75 60.47,74.75 60.64,74.93 60.64,75.25 65.09,79.69 v65.09,85.72
SWDIO  (via drill 0.5)
  Top 0.254: v59.37,73.65 59.22,73.8 57.8,73.8 56.98,74.61 54.29,74.61 53.87,74.19 IC2.46 | v66.04,84.45 72.07,84.45 75.25,81.28 JP1.2
  Bottom 0.254: v59.37,73.65 59.38,73.66 60.33,73.66 61.28,74.61 61.28,74.93 65.72,79.38 65.72,83.19 66.04,83.5 v66.04,84.45
T_CLOCK
  Top 0.254: IC2.40 50.87,67.56 51.28,67.15 51.28,65.41 49.05,63.18 49.05,57.63 48.71,57.28 36.96,57.28 35.99,56.31 R22.1 36.09,54.49 Q2.C
TX  (via drill 0.5)
  Top 0.254: v51.75,89.53 51.44,89.85 51.44,94.61 52.21,95.39 R2.2 | v50.8,77.15 51.87,76.08 IC2.42
  Bottom 0.254: v51.75,89.53 50.8,88.58 v50.8,77.15
VCC  (via drill 0.5, 0.6)
  Top 0.254: IC7.4 v64.77,35.56 64.69,35.64 C39.1 | v48.91,32.7 48.91,32.05 49.96,31 C48.1 50.21,31.11 IC10.4 | IC9.4 37.84,31.92 37.52,31.6 36.83,31.6 C50.1 36.58,31.94 36.31,32.21 36.34,32.21 v36.34,32.73
  Top 0.406: v4.13,33.02 4.13,33.66 3.17,34.61 3.17,56.2 10.79,63.82 10.79,75.25 8.89,77.15 8.89,79.38 10.79,81.28 10.79,84.45 12.21,85.87 C11.+ 14.33,85.87 L2.1
  Bottom 0.406: v4.13,33.02 9.21,33.02 9.53,32.7 v36.34,32.73 v48.91,32.7 61.91,32.7 v64.77,35.56
VEE  (via drill 0.5)
  Top 0.254: IC7.11 v73.03,35.56 73.19,35.72 C37.2 | v60.96,31.75 60.33,31.11 59.57,31.11 C49.2 59.5,31.11 IC10.11 | v29.38,31.74 28.55,32.56 R68.1
  Top 0.406: v2.86,32.07 2.86,33.66 2.22,34.29 2.22,57.47 1.59,58.1 1.59,59.69 8.08,66.19 C22.- 8.08,69.25 L4.1
  Bottom 0.305: 7.3,32.07 7.62,32.38 8.89,32.38 9.53,31.75
  Bottom 0.406: v2.86,32.07 7.3,32.07 | 9.53,31.75 27.99,31.74 v29.37,31.74 v29.38,31.74 | v29.38,31.74 | v29.38,31.74 31.94,31.74 v60.96,31.75 62.23,31.75 66.04,35.56 v73.03,35.56
VREF  (via drill 0.5)
  Top 0.254: v68.78,52.13 71.23,52.13 77.15,46.22 77.15,32.7 78.5,31.36 R74.2 | v64.26,52.25 59.2,52.25 56.83,54.61 56.83,59.84 57.88,59.85 C25.1 | C25.1 | C25.1 56.5,60.54 IC4.3
  Bottom 0.254: v68.78,52.13 64.38,52.13 v64.26,52.25
VREF_BIAS  (via drill 0.5)
  Top 0.254: 70.48,34.92 70.48,33.92 69.25,32.99 v69.25,32.38 | 70.48,34.92 70.48,35.88 70.82,36.21 IC7.12 | v76.2,32.7 76.35,32.55 76.35,29.38 75.46,28.49 C51.1 74.64,27.66 R74.1 76.67,27.66 77.53,26.81 79.09,26.81 80.15,27.86 82.53,27.86 R73.2 | 70.48,34.92 70.5,34.91 IC7.10 | IC7.3 67.07,36.21 67.44,35.84 67.44,34.9 | v66.2,32.41 66.67,32.41 67.44,33.18 67.44,34.9 | IC7.5 67.43,34.91 67.44,34.9
  Bottom 0.254: v66.2,32.41 66.22,32.4 v69.25,32.38 75.89,32.4 v76.2,32.7
X_CLOCK
  Top 0.254: IC2.41 51.37,67.69 51.75,67.31 51.75,65.25 49.53,63.02 49.53,57.47 48.26,56.2 41.57,56.2 R23.1 41.57,54.95 40.89,54.28 Q3.C

## Text on the board
bNames: Red Stripe | +12V | GND | GND | GND | -12V | Marbles | cc-by-sa Émilie Gillet | 2017. v7
tStop: Marbles | cc-by-sa Émilie Gillet | 2017. v7